# Altium schematic sheet l4.schdoc
size 83 x 131 mm
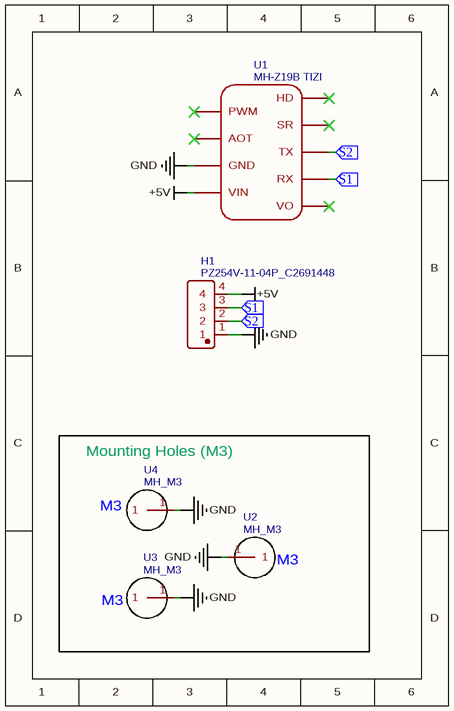
[diagram p0: l4.schdoc]

## Parts
H1  PZ254V-11-04P_C2691448  [HDR-TH_4P-P2.54-V-M]
U1  MH-Z19B TIZI  [MH-Z19B]
U2  MH_M3  [MH_M3_PCB]
U3  MH_M3  [MH_M3_PCB]
U4  MH_M3  [MH_M3_PCB]

## Blocks framed on the sheet
Mounting Holes (M3): U2-U4

## Ports
S1 (in), S2 (in)

## Nets
+5V: H1.4 U1.6(VIN)
GND: H1.1 U1.7(GND) U2.1 U3.1 U4.1
S1: H1.3 U1.2(RX) ; port S1
S2: H1.2 U1.3(TX) ; port S2

Not connected (* = marked no-connect by the designer): U1 1(VO)* 4(SR)* 5(HD)* 8(AOT)* 9(PWM)*

## Notes on the sheet
- (in symbol MH_M3) M3

## Library data of the parts
H1 = PZ254V-11-04P_C2691448: Manufacturer: XFCN(兴飞); Contributor: LCSC; Supplier: LCSC; Supplier Part: C2691448; Manufacturer Part: PZ254V-11-04P; JLCPCB Part Class: Extended Part; spicePre: H; spiceSymbolName: PZ254V-11-04P_C2691448
U1 = MH-Z19B TIZI: Contributor: tiziano8923; spicePre: U; spiceSymbolName: MH-Z19B TIZI
U2-U4 = MH_M3: Contributor: js314dev; spicePre: U; spiceSymbolName: MH_M3